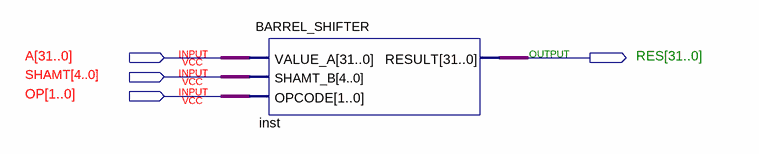
[diagram p0: schematic sheet]
// Quartus schematic BARREL_SHIFTERTEST.bdf as structural Verilog: 1 symbols, 4 pins
module BARREL_SHIFTERTEST (
  input  [31:0] A,
  input  [4:0] SHAMT,
  input  [1:0] OP,
  output [31:0] RES
);

  BARREL_SHIFTER inst (.VALUE_A(A), .SHAMT_B(SHAMT), .OPCODE(OP), .RESULT(RES));
endmodule
